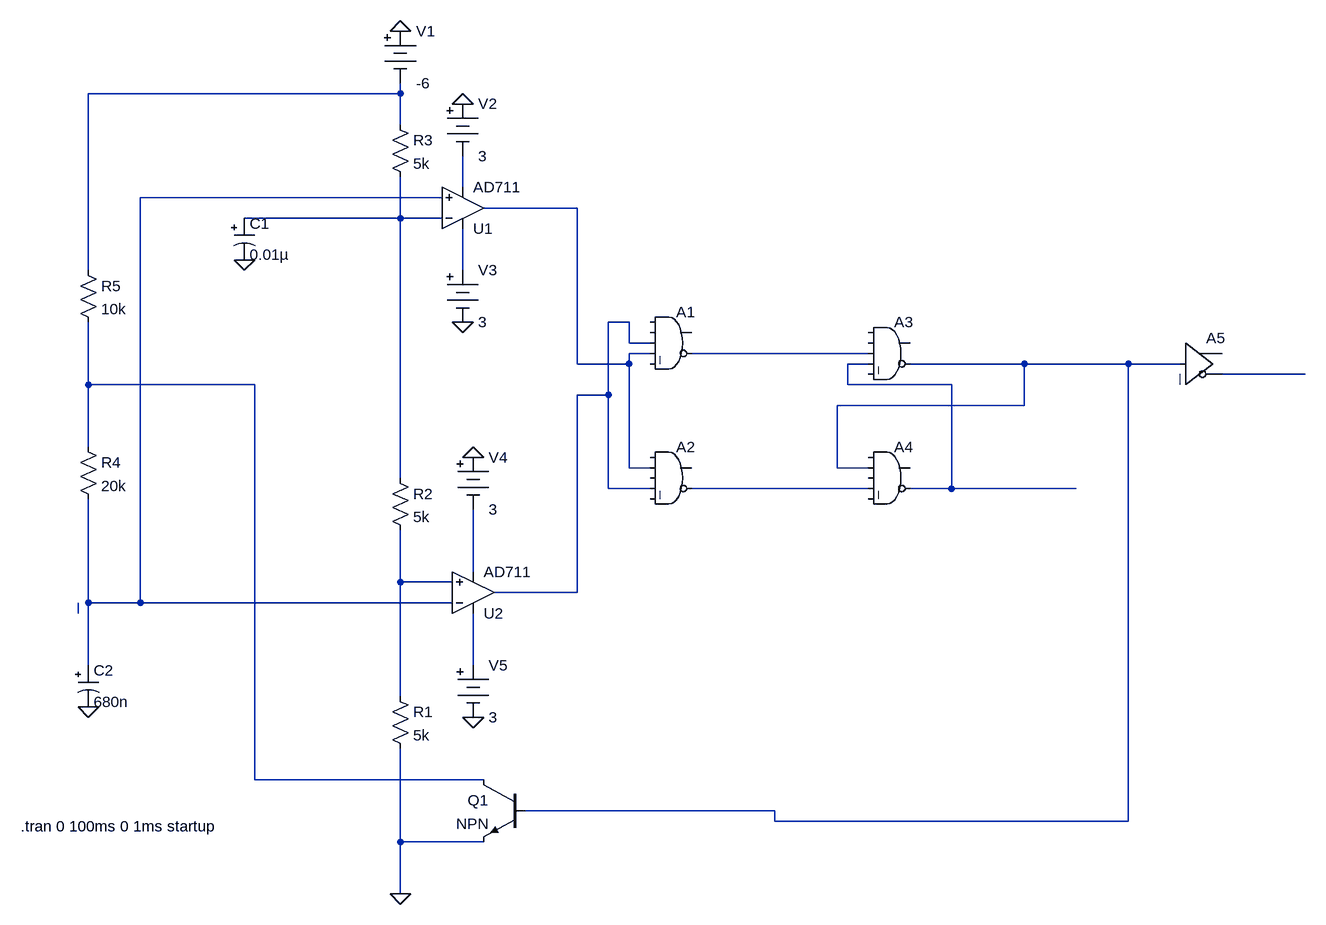
[diagram p0: schematic Astable2.asc]
Astable2.asc, the LTspice schematic file:
Version 4
SHEET 1 1412 964
WIRE 16 -288 16 -304
WIRE 16 -288 -464 -288
WIRE 16 -240 16 -288
WIRE 112 -144 112 -192
WIRE 80 -128 -384 -128
WIRE 288 -112 144 -112
WIRE 16 -96 16 -160
WIRE 16 -96 -224 -96
WIRE 80 -96 16 -96
WIRE -464 -16 -464 -288
WIRE 112 -16 112 -80
WIRE 368 64 336 64
WIRE 368 96 368 64
WIRE 400 96 368 96
WIRE 400 112 368 112
WIRE 736 112 464 112
WIRE 288 128 288 -112
WIRE 368 128 368 112
WIRE 368 128 288 128
WIRE 736 128 704 128
WIRE 976 128 800 128
WIRE 1136 128 976 128
WIRE 1216 128 1136 128
WIRE 1408 144 1280 144
WIRE -464 160 -464 64
WIRE -208 160 -464 160
WIRE 704 160 704 128
WIRE 864 160 704 160
WIRE 336 176 336 64
WIRE 336 176 288 176
WIRE 976 192 976 128
WIRE 976 192 688 192
WIRE -464 256 -464 160
WIRE 368 288 368 128
WIRE 400 288 368 288
WIRE 688 288 688 192
WIRE 736 288 688 288
WIRE 16 304 16 -96
WIRE 336 320 336 176
WIRE 400 320 336 320
WIRE 736 320 464 320
WIRE 864 320 864 160
WIRE 864 320 800 320
WIRE 1056 320 864 320
WIRE 128 448 128 352
WIRE 16 464 16 384
WIRE 96 464 16 464
WIRE 288 480 288 176
WIRE 288 480 160 480
WIRE -464 496 -464 336
WIRE -384 496 -384 -128
WIRE -384 496 -464 496
WIRE 96 496 -384 496
WIRE -480 512 -480 496
WIRE -464 592 -464 496
WIRE 128 592 128 512
WIRE 16 640 16 464
WIRE -208 768 -208 160
WIRE 144 768 -208 768
WIRE 592 816 208 816
WIRE 592 832 592 816
WIRE 1136 832 1136 128
WIRE 1136 832 592 832
WIRE 16 864 16 720
WIRE 144 864 16 864
WIRE 16 944 16 864
FLAG 16 944 0
FLAG -224 -32 0
FLAG -464 656 0
FLAG 16 -384 0
FLAG 112 -272 0
FLAG 112 64 0
FLAG 128 272 0
FLAG 128 672 0
DATAFLAG 1376 144 ""
DATAFLAG 1360 144 ""
DATAFLAG 1360 144 ""
DATAFLAG 1360 144 ""
DATAFLAG 1360 144 ""
DATAFLAG 1360 144 ""
DATAFLAG 1312 144 ""
DATAFLAG 1328 144 ""
DATAFLAG 1328 144 ""
DATAFLAG 1328 144 ""
DATAFLAG 1168 128 ""
DATAFLAG 1344 144 ""
SYMBOL res 0 624 R0
SYMATTR InstName R1
SYMATTR Value 5k
SYMBOL res 0 288 R0
SYMATTR InstName R2
SYMATTR Value 5k
SYMBOL res 0 -256 R0
SYMATTR InstName R3
SYMATTR Value 5k
SYMBOL Misc\\battery 16 -400 R0
WINDOW 123 0 0 Left 0
WINDOW 39 0 0 Left 0
SYMATTR InstName V1
SYMATTR Value -6
SYMBOL res -480 240 R0
SYMATTR InstName R4
SYMATTR Value 20k
SYMBOL res -480 -32 R0
SYMATTR InstName R5
SYMATTR Value 10k
SYMBOL polcap -240 -96 R0
SYMATTR InstName C1
SYMATTR Value 0.01µ
SYMBOL polcap -480 592 R0
SYMATTR InstName C2
SYMATTR Value 680n
SYMBOL Misc\\battery 112 -288 R0
WINDOW 123 0 0 Left 0
WINDOW 39 0 0 Left 0
SYMATTR InstName V2
SYMATTR Value 3
SYMBOL Misc\\battery 112 -32 R0
WINDOW 123 0 0 Left 0
WINDOW 39 0 0 Left 0
SYMATTR InstName V3
SYMATTR Value 3
SYMBOL Misc\\battery 128 256 R0
WINDOW 123 0 0 Left 0
WINDOW 39 0 0 Left 0
SYMATTR InstName V4
SYMATTR Value 3
SYMBOL Misc\\battery 128 576 R0
WINDOW 123 0 0 Left 0
WINDOW 39 0 0 Left 0
SYMATTR InstName V5
SYMATTR Value 3
SYMBOL npn 208 768 M0
SYMATTR InstName Q1
SYMBOL Digital\\and 432 32 R0
SYMATTR InstName A1
SYMBOL Digital\\and 432 240 R0
SYMATTR InstName A2
SYMBOL Digital\\and 768 48 R0
SYMATTR InstName A3
SYMBOL Digital\\and 768 240 R0
SYMATTR InstName A4
SYMBOL Digital\\buf 1216 64 R0
SYMATTR InstName A5
SYMATTR SpiceLine Vhigh=6 Vlow=0 Ref=0.5
SYMBOL OpAmps\\AD711 112 -48 M180
SYMATTR InstName U1
SYMBOL OpAmps\\AD711 128 544 M180
SYMATTR InstName U2
TEXT -568 840 Left 2 !.tran 0 100ms 0 1ms startup

The netlist it stands for:
* Astable2.asc
R1 N015 0 5k
R2 N005 N015 5k
R3 N001 N005 5k
V1 0 N001 -6
R4 N012 N003 20k
R5 N001 N012 10k
C1 N005 0 0.01µ
C2 N003 0 680n
V2 0 N002 3
V3 N006 0 3
V4 0 N014 3
V5 N017 0 3
Q1 N012 N010 0 0 NPN
A1 0 0 N007 N004 0 N008 0 0 AND
A2 0 N004 0 N007 0 N013 0 0 AND
A3 0 0 N008 N009 0 N010 0 0 AND
A4 0 N010 0 N013 0 N009 0 0 AND
A5 N010 0 0 0 0 N011 0 0 BUF Vhigh=6 Vlow=0 Ref=0.5
XU1 N003 N005 N006 N002 N004 AD712  ; AD711, pins In+ In- V+ V- OUT
XU2 N015 N003 N017 N014 N007 AD712  ; AD711, pins In+ In- V+ V- OUT
.model NPN NPN
.model PNP PNP
.lib standard.bjt
.tran 0 100ms 0 1ms startup
.lib ADI1.lib
.backanno
.end